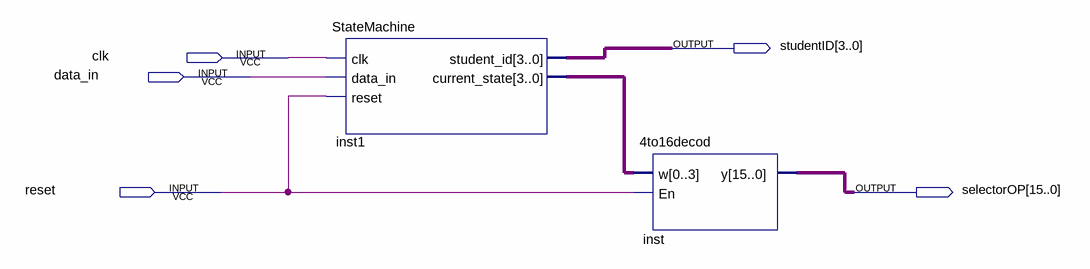
[diagram p0: schematic sheet]
// Quartus schematic controlblock.bdf as structural Verilog: 2 symbols, 5 pins
module controlblock (
  input  clk,
  input  data_in,
  input  reset,
  output [3:0] studentID,
  output [15:0] selectorOP
);

  wire [3:0] inst1_current_state;

  StateMachine inst1 (
    .clk(clk), .data_in(data_in), .reset(reset), .student_id(studentID), .current_state(inst1_current_state));
  \4to16decod  inst (.w(inst1_current_state), .En(reset), .y(selectorOP));
endmodule
